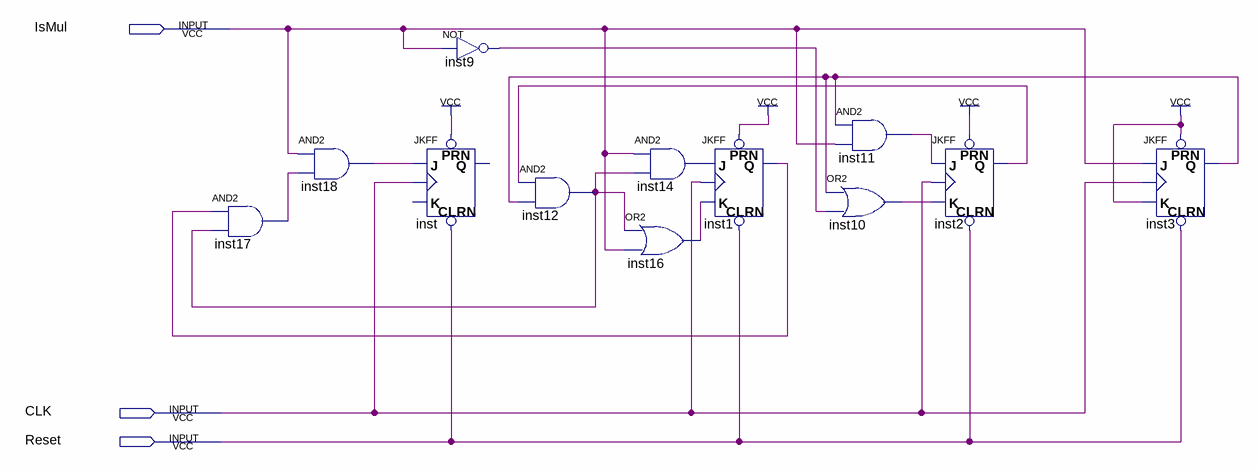
[diagram p0: schematic sheet]
// Quartus schematic counter.bdf as structural Verilog: 12 symbols, 3 pins
module counter (
  input  IsMul,
  input  CLK,
  input  Reset
);

  wire inst1_q, inst2_q, inst3_q, inst9_out, inst10_out, inst11_out, inst12_out, inst16_out, inst17_out,
       inst18_out;

  and inst17 (inst17_out, inst1_q, inst12_out);
  and inst18 (inst18_out, IsMul, inst17_out);
  not inst9 (inst9_out, IsMul);
  JKFF inst (.PRN(1'b1), .CLRN(Reset), .J(inst18_out), .CLK(CLK));  // open: K, Q
  and inst12 (inst12_out, inst2_q, inst3_q);
  // AND2 inst14 has open pins: IN1=IsMul, IN2=inst12_out, OUT=open
  or inst16 (inst16_out, inst12_out, IsMul);
  JKFF inst1 (.PRN(1'b1), .CLRN(Reset), .K(inst16_out), .CLK(CLK), .Q(inst1_q));  // open: J
  and inst11 (inst11_out, inst3_q, IsMul);
  or inst10 (inst10_out, inst3_q, inst9_out);
  JKFF inst2 (.PRN(1'b1), .CLRN(Reset), .K(inst10_out), .J(inst11_out), .CLK(CLK), .Q(inst2_q));
  JKFF inst3 (.PRN(1'b1), .CLRN(Reset), .K(1'b1), .J(IsMul), .CLK(CLK), .Q(inst3_q));
endmodule
